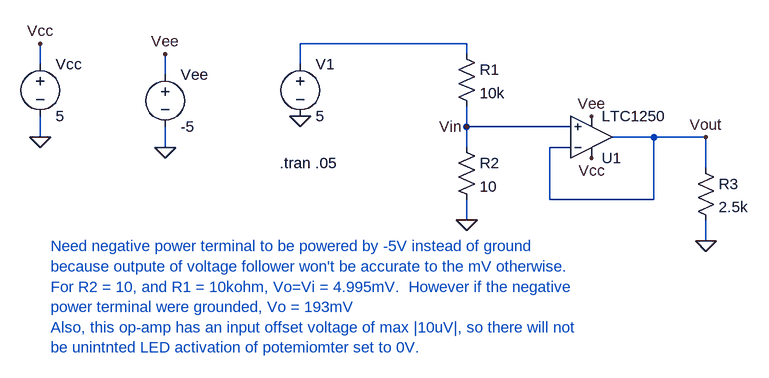
[diagram p0: schematic RhiControl_LTC1250.asc]
RhiControl_LTC1250.asc, the LTspice schematic file:
Version 4
SHEET 1 880 680
WIRE -80 80 -336 80
WIRE -80 96 -80 80
WIRE -736 112 -736 80
WIRE -336 112 -336 80
WIRE -544 128 -544 96
WIRE -80 208 -80 176
WIRE 80 208 -80 208
WIRE -736 224 -736 192
WIRE 208 224 144 224
WIRE 288 224 208 224
WIRE -544 240 -544 208
WIRE -80 240 -80 208
WIRE 80 240 48 240
WIRE 288 272 288 224
WIRE 48 320 48 240
WIRE 208 320 208 224
WIRE 208 320 48 320
WIRE -80 352 -80 320
WIRE 288 384 288 352
FLAG -736 80 Vcc
FLAG -736 224 0
FLAG 288 384 0
FLAG -336 192 0
FLAG -80 352 0
FLAG 112 256 Vcc
FLAG -80 208 Vin
FLAG 288 224 Vout
FLAG -544 96 Vee
FLAG -544 240 0
FLAG 112 192 Vee
SYMBOL voltage -736 96 R0
WINDOW 123 0 0 Left 0
WINDOW 39 0 0 Left 0
SYMATTR InstName Vcc
SYMATTR Value 5
SYMBOL res 272 256 R0
SYMATTR InstName R3
SYMATTR Value 2.5k
SYMBOL voltage -336 96 R0
WINDOW 123 0 0 Left 0
WINDOW 39 0 0 Left 0
SYMATTR InstName V1
SYMATTR Value 5
SYMBOL res -96 80 R0
SYMATTR InstName R1
SYMATTR Value 10k
SYMBOL res -96 224 R0
SYMATTR InstName R2
SYMATTR Value 10
SYMBOL OpAmps\\LTC1250 112 288 M180
SYMATTR InstName U1
SYMBOL voltage -544 112 R0
WINDOW 123 0 0 Left 0
WINDOW 39 0 0 Left 0
SYMATTR InstName Vee
SYMATTR Value -5
TEXT -368 264 Left 2 !.tran .05
TEXT -720 392 Left 2 ;Need negative power terminal to be powered by -5V instead of ground\nbecause outpute of voltage follower won't be accurate to the mV otherwise.\nFor R2 = 10, and R1 = 10kohm, Vo=Vi = 4.995mV.  However if the negative\npower terminal were grounded, Vo = 193mV\nAlso, this op-amp has an input offset voltage of max |10uV|, so there will not\nbe unintnted LED activation of potemiomter set to 0V.

The netlist it stands for:
* RhiControl_LTC1250.asc
Vcc Vcc 0 5
R3 Vout 0 2.5k
V1 N001 0 5
R1 N001 Vin 10k
R2 Vin 0 10
XU1 Vin Vout Vcc Vee Vout LTC1250  ; pins In+ In- V+ V- OUT
Vee Vee 0 -5
.tran .05
* Need negative power terminal to be powered by -5V instead of ground
* because outpute of voltage follower won't be accurate to the mV otherwise.
* For R2 = 10, and R1 = 10kohm, Vo=Vi = 4.995mV.  However if the negative
* power terminal were grounded, Vo = 193mV
* Also, this op-amp has an input offset voltage of max |10uV|, so there will not
* be unintnted LED activation of potemiomter set to 0V.
.backanno
.end